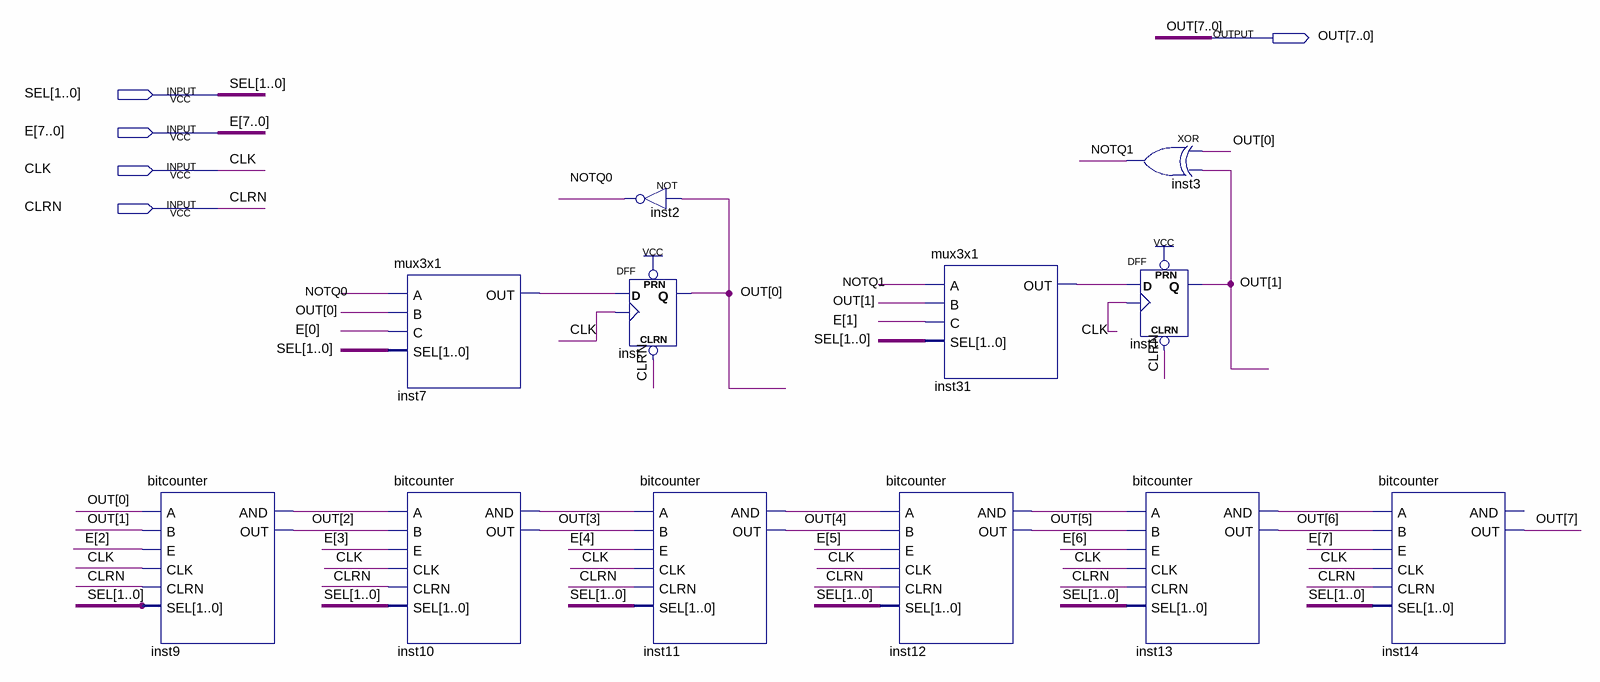
[diagram p0: schematic sheet]
// Quartus schematic counter.bdf as structural Verilog: 12 symbols, 5 pins
module counter (
  input  [1:0] SEL,
  input  [7:0] E,
  input  CLK,
  input  CLRN,
  output [7:0] OUT
);

  wire inst7_out, inst9_and, inst10_and, inst11_and, inst12_and, inst13_and, inst31_out, NOTQ0, NOTQ1;

  bitcounter inst9 (.A(OUT[0]), .B(OUT[1]), .E(E[2]), .CLK(CLK), .CLRN(CLRN), .SEL(SEL), .AND(inst9_and), .OUT(OUT[2]));
  mux3x1 inst7 (.A(NOTQ0), .B(OUT[0]), .C(E[0]), .SEL(SEL), .OUT(inst7_out));
  bitcounter inst10 (
    .A(inst9_and), .B(OUT[2]), .E(E[3]), .CLK(CLK), .CLRN(CLRN), .SEL(SEL), .AND(inst10_and), .OUT(OUT[3]));
  not inst2 (NOTQ0, OUT[0]);
  DFF inst (.CLRN(CLRN), .CLK(CLK), .D(inst7_out), .PRN(1'b1), .Q(OUT[0]));
  bitcounter inst11 (
    .A(inst10_and), .B(OUT[3]), .E(E[4]), .CLK(CLK), .CLRN(CLRN), .SEL(SEL), .AND(inst11_and), .OUT(OUT[4]));
  mux3x1 inst31 (.A(NOTQ1), .B(OUT[1]), .C(E[1]), .SEL(SEL), .OUT(inst31_out));
  bitcounter inst12 (
    .A(inst11_and), .B(OUT[4]), .E(E[5]), .CLK(CLK), .CLRN(CLRN), .SEL(SEL), .AND(inst12_and), .OUT(OUT[5]));
  xor inst3 (NOTQ1, OUT[0], OUT[1]);
  DFF inst1 (.CLRN(CLRN), .CLK(CLK), .D(inst31_out), .PRN(1'b1), .Q(OUT[1]));
  bitcounter inst13 (
    .A(inst12_and), .B(OUT[5]), .E(E[6]), .CLK(CLK), .CLRN(CLRN), .SEL(SEL), .AND(inst13_and), .OUT(OUT[6]));
  bitcounter inst14 (
    .A(inst13_and), .B(OUT[6]), .E(E[7]), .CLK(CLK), .CLRN(CLRN), .SEL(SEL), .OUT(OUT[7]));  // open: AND
endmodule
